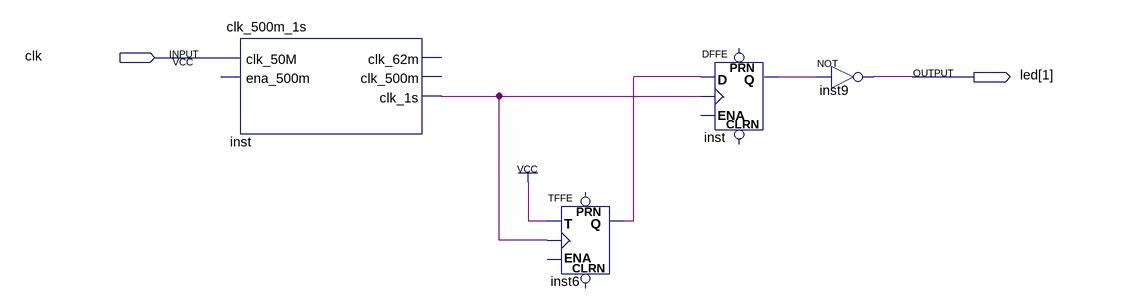
[diagram p0: schematic sheet]
// Quartus schematic test_dffe_bahaviour.bdf as structural Verilog: 4 symbols, 2 pins
module test_dffe_bahaviour (
  input  clk,
  output [1:1] led
);

  wire inst6_q, inst_clk_1s, inst_q;

  clk_500m_1s inst (.clk_50M(clk), .clk_1s(inst_clk_1s));  // open: ena_500m, clk_62m, clk_500m
  TFFE inst6 (.T(1'b1), .CLK(inst_clk_1s), .Q(inst6_q));  // open: CLRN, ENA, PRN
  DFFE inst_dup2 (.D(inst6_q), .CLK(inst_clk_1s), .Q(inst_q));  // open: PRN, CLRN, ENA
  not inst9 (led[1], inst_q);
endmodule
